# Altium project DS1307.PrjPcb
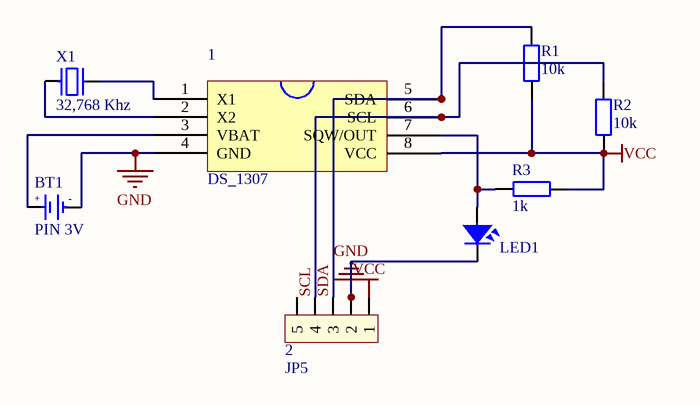
[diagram p0: Sheet1.SchDoc]
1 sheet, 8 parts. Net scope: global (net labels, ports and power ports of the same name join across sheets).
Board file: PCB1.PcbDoc

## Sheet Sheet1.SchDoc
size A

### Parts
1  DS_1307  [DIP8_DS1307]
2  JP5  [JP5]
BT1  PIN 3V  [PIN3V]
LED1  LED  [LED-3]  (value not drawn)
R1  10k  [R1/2W]
R2  10k  [R1/2W]
R3  1k  [R1/4W]
X1  32,768 Khz  [XT32k]

### Nets
GND: 1.4(GND) 2.2 BT1.2(GND) LED1.2
VCC: 1.8(VCC) 2.1 R1.1 R2.1 R3.2
SCL: 1.6(SCL) 2.4 R2.2
SDA: 1.5(SDA) 2.3 R1.2
Net1_1: 1.1(X1) X1.2
Net1_2: 1.2(X2) X1.1
Net1_3: 1.3(VBAT) BT1.1(+3V)
Net1_7: 1.7(SQW/OUT) LED1.1 R3.1

Not connected (* = marked no-connect by the designer): 2 5

### Notes on the sheet
- (in symbol PIN 3V) +; -

### Library data of the parts
BT1 = PIN 3V: Battery 3VDC; Value: PIN 3V
LED1 = LED: LED Single colour Green and Red; Value: LED 3 ly Single Colour
R1-R3 = R1/4W: Resistor 1/4W; Value: R1/4W - 1K
X1 = XT32k: Crystal 32,768kHz for timer real; Value: 32,768khz